# EasyEDA schematic Magellan ISO - Logic Board.json
TITLE: Magellan ISO - Logic Board; REV: 1.0; Date: 2017-10-26; Sheet: 1/1; Drawn By: mgizmor37
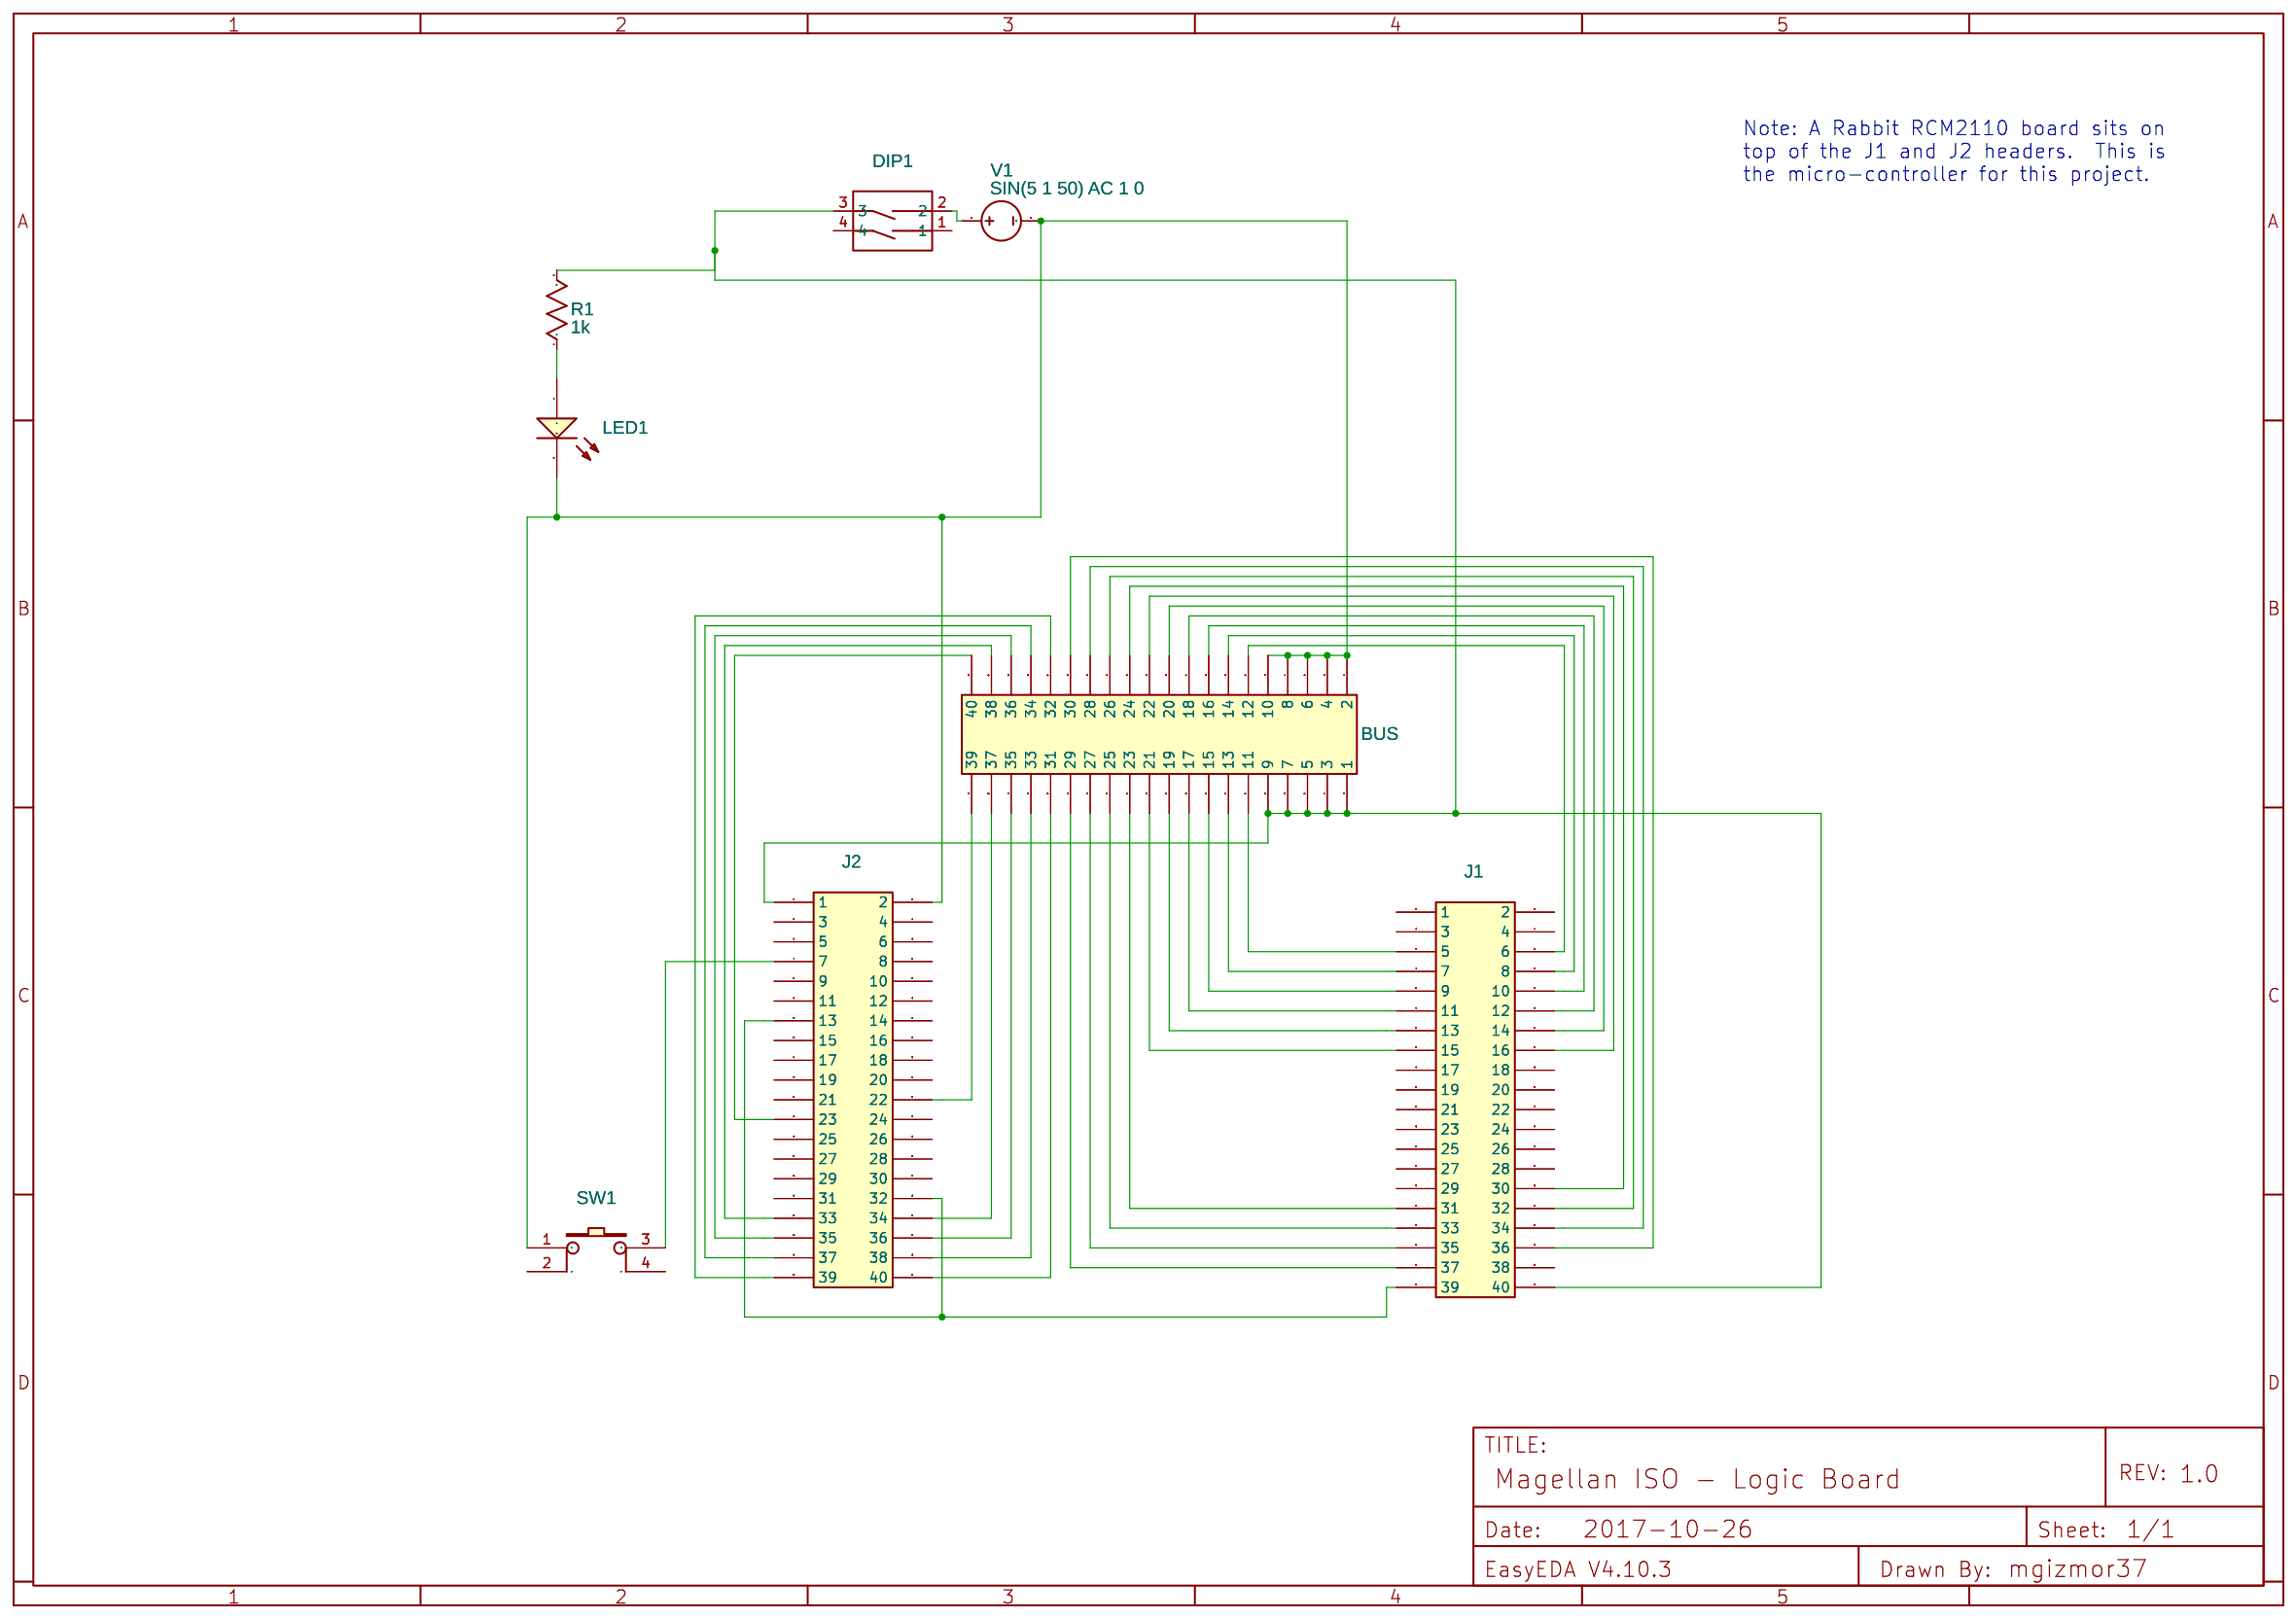
[diagram p0: schematic sheet]

## Parts
BUS  Header-Male-2.54_2x20  [HDR-20X2/2.54]
DIP1  VDG-02HG-R  [VDG-02HG-R]
J1  Header-Female-2.0_2x20  [HDR-20X2/2.0]
J2  Header-Female-2.0_2x20  [HDR-20X2/2.0]
LED1  204-10UYC/S530-A3  [LED-3MM/2.54]
R1  1k  [AXIAL-0.3]
SW1  SWITCH-6x6x5_TH  [SWITCH-6X6X5_TH]
V1  SIN(5 1 50) AC 1 0  [HDR1X2]

## Library data of the parts
BUS = -: Supplier: LCSC; Manufacturer: ReliaPro; Manufacturer Part: 2.54mm 2*20PHeader; LCSC: C50980
DIP1 = -: LCSC: C3661; Supplier: LCSC; Manufacturer: LCSC
J1 J2 = -: Supplier: LCSC; Manufacturer: ReliaPro; Manufacturer Part: Female header2*10P; LCSC: C75756
LED1 = -: LCSC: C73643; Supplier: LCSC; Manufacturer: EVERLIGHT
R1 = Resistor: Manufacturer Part: ?
SW1 = -: LCSC: C69330; Supplier: LCSC; Manufacturer: LCSC
V1 = Vsin: Manufacturer Part: ?; power_0: 5

## Nets
Net-(BUS-1): BUS.1(2) BUS.3(4) BUS.5(6) BUS.7(8) BUS.9(10) J2.2 LED1.2(C) SW1.1 V1.2
Net-(BUS-2): BUS.2(1) BUS.4(3) BUS.6(5) BUS.8(7) BUS.10(9) DIP1.3 J1.40 J2.1 R1.2
Net-(BUS-11): BUS.11(12) J1.6
Net-(BUS-12): BUS.12(11) J1.5
Net-(BUS-13): BUS.13(14) J1.8
Net-(BUS-14): BUS.14(13) J1.7
Net-(BUS-15): BUS.15(16) J1.10
Net-(BUS-16): BUS.16(15) J1.9
Net-(BUS-17): BUS.17(18) J1.12
Net-(BUS-18): BUS.18(17) J1.11
Net-(BUS-19): BUS.19(20) J1.14
Net-(BUS-20): BUS.20(19) J1.13
Net-(BUS-21): BUS.21(22) J1.16
Net-(BUS-22): BUS.22(21) J1.15
Net-(BUS-23): BUS.23(24) J1.30
Net-(BUS-24): BUS.24(23) J1.31
Net-(BUS-25): BUS.25(26) J1.32
Net-(BUS-26): BUS.26(25) J1.33
Net-(BUS-27): BUS.27(28) J1.34
Net-(BUS-28): BUS.28(27) J1.35
Net-(BUS-29): BUS.29(30) J1.36
Net-(BUS-30): BUS.30(29) J1.37
Net-(BUS-31): BUS.31(32) J2.39
Net-(BUS-32): BUS.32(31) J2.40
Net-(BUS-33): BUS.33(34) J2.37
Net-(BUS-34): BUS.34(33) J2.38
Net-(BUS-35): BUS.35(36) J2.35
Net-(BUS-36): BUS.36(35) J2.36
Net-(BUS-37): BUS.37(38) J2.33
Net-(BUS-38): BUS.38(37) J2.34
Net-(BUS-39): BUS.39(40) J2.23
Net-(BUS-40): BUS.40(39) J2.22
Net-(DIP1-2): DIP1.2 V1.1
Net-(J1-39): J1.39 J2.13 J2.32
Net-(J2-7): J2.7 SW1.3
Net-(LED1-1): LED1.1(A) R1.1

Not connected (* = marked no-connect by the designer): DIP1 1 4; J1 1 2 3 4 17 18 19 20 21 22 23 24 25 26 27 28 29 38; J2 3 4 5 6 8 9 10 11 12 14 15 16 17 18 19 20 21 24 25 26 27 28 29 30 31; SW1 2 4

## Notes on the sheet
- Note: A Rabbit RCM2110 board sits on
  top of the J1 and J2 headers.  This is
  the micro-controller for this project.
